# EAGLE design quad7seg (EAGLE 7.3.0)
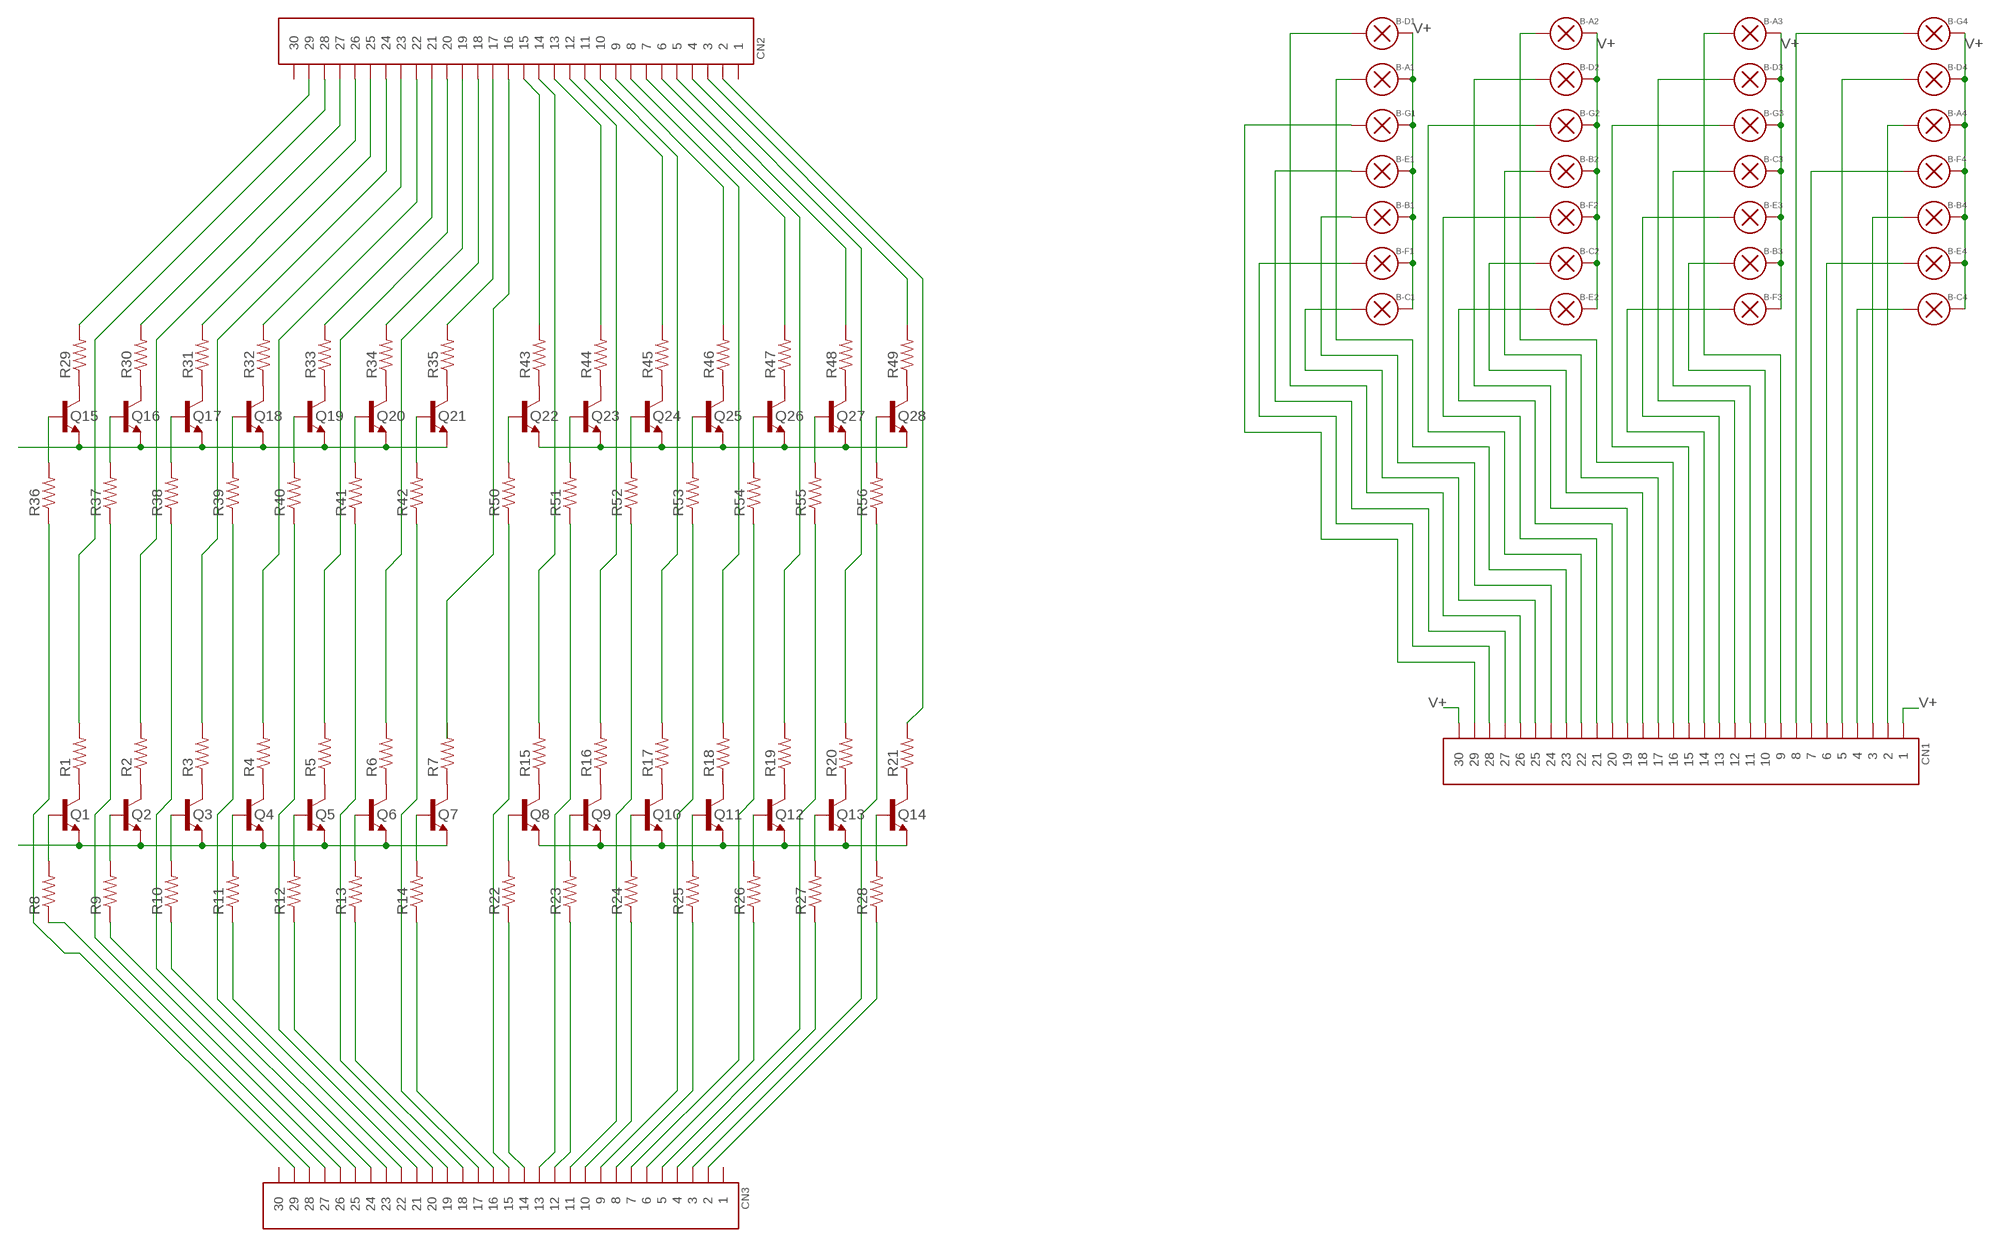
[diagram p0: schematic, sheet 1]

## Parts
B-A1  BULB-N  [4X11BULB1]
B-A2  BULB-N  [4X11BULB1]
B-A3  BULB-N  [4X11BULB1]
B-A4  BULB-N  [4X11BULB1]
B-B1  BULB-F  [4X11BULB2]
B-B2  BULB-F  [4X11BULB2]
B-B3  BULB-F  [4X11BULB2]
B-B4  BULB-F  [4X11BULB2]
B-C1  BULB-F  [4X11BULB2]
B-C2  BULB-F  [4X11BULB2]
B-C3  BULB-F  [4X11BULB2]
B-C4  BULB-F  [4X11BULB2]
B-D1  BULB-N  [4X11BULB1]
B-D2  BULB-N  [4X11BULB1]
B-D3  BULB-N  [4X11BULB1]
B-D4  BULB-N  [4X11BULB1]
B-E1  BULB-F  [4X11BULB2]
B-E2  BULB-F  [4X11BULB2]
B-E3  BULB-F  [4X11BULB2]
B-E4  BULB-F  [4X11BULB2]
B-F1  BULB-F  [4X11BULB2]
B-F2  BULB-F  [4X11BULB2]
B-F3  BULB-F  [4X11BULB2]
B-F4  BULB-F  [4X11BULB2]
B-G1  BULB-N  [4X11BULB1]
B-G2  BULB-N  [4X11BULB1]
B-G3  BULB-N  [4X11BULB1]
B-G4  BULB-N  [4X11BULB1]
CN1  HD30  [HD30]
CN2  HD30  [HD30]
CN3  HD30  [HD30]
Q1  2N3904-1  [TO92BH]
Q2  2N3904-1  [TO92BH]
Q3  2N3904-1  [TO92BH]
Q4  2N3904-1  [TO92BH]
Q5  2N3904-1  [TO92BH]
Q6  2N3904-1  [TO92BH]
Q7  2N3904-1  [TO92BH]
Q8  2N3904-1  [TO92BH]
Q9  2N3904-1  [TO92BH]
Q10  2N3904-1  [TO92BH]
Q11  2N3904-1  [TO92BH]
Q12  2N3904-1  [TO92BH]
Q13  2N3904-1  [TO92BH]
Q14  2N3904-1  [TO92BH]
Q15  2N3904-1  [TO92BH]
Q16  2N3904-1  [TO92BH]
Q17  2N3904-1  [TO92BH]
Q18  2N3904-1  [TO92BH]
Q19  2N3904-1  [TO92BH]
Q20  2N3904-1  [TO92BH]
Q21  2N3904-1  [TO92BH]
Q22  2N3904-1  [TO92BH]
Q23  2N3904-1  [TO92BH]
Q24  2N3904-1  [TO92BH]
Q25  2N3904-1  [TO92BH]
Q26  2N3904-1  [TO92BH]
Q27  2N3904-1  [TO92BH]
Q28  2N3904-1  [TO92BH]
R1  R1/8-7.6MM  [R0125-7.6]
R2  R1/8-7.6MM  [R0125-7.6]
R3  R1/8-7.6MM  [R0125-7.6]
R4  R1/8-7.6MM  [R0125-7.6]
R5  R1/8-7.6MM  [R0125-7.6]
R6  R1/8-7.6MM  [R0125-7.6]
R7  R1/8-7.6MM  [R0125-7.6]
R8  R1/8-7.6MM  [R0125-7.6]
R9  R1/8-7.6MM  [R0125-7.6]
R10  R1/8-7.6MM  [R0125-7.6]
R11  R1/8-7.6MM  [R0125-7.6]
R12  R1/8-7.6MM  [R0125-7.6]
R13  R1/8-7.6MM  [R0125-7.6]
R14  R1/8-7.6MM  [R0125-7.6]
R15  R1/8-7.6MM  [R0125-7.6]
R16  R1/8-7.6MM  [R0125-7.6]
R17  R1/8-7.6MM  [R0125-7.6]
R18  R1/8-7.6MM  [R0125-7.6]
R19  R1/8-7.6MM  [R0125-7.6]
R20  R1/8-7.6MM  [R0125-7.6]
R21  R1/8-7.6MM  [R0125-7.6]
R22  R1/8-7.6MM  [R0125-7.6]
R23  R1/8-7.6MM  [R0125-7.6]
R24  R1/8-7.6MM  [R0125-7.6]
R25  R1/8-7.6MM  [R0125-7.6]
R26  R1/8-7.6MM  [R0125-7.6]
R27  R1/8-7.6MM  [R0125-7.6]
R28  R1/8-7.6MM  [R0125-7.6]
R29  R1/8-7.6MM  [R0125-7.6]
R30  R1/8-7.6MM  [R0125-7.6]
R31  R1/8-7.6MM  [R0125-7.6]
R32  R1/8-7.6MM  [R0125-7.6]
R33  R1/8-7.6MM  [R0125-7.6]
R34  R1/8-7.6MM  [R0125-7.6]
R35  R1/8-7.6MM  [R0125-7.6]
R36  R1/8-7.6MM  [R0125-7.6]
R37  R1/8-7.6MM  [R0125-7.6]
R38  R1/8-7.6MM  [R0125-7.6]
R39  R1/8-7.6MM  [R0125-7.6]
R40  R1/8-7.6MM  [R0125-7.6]
R41  R1/8-7.6MM  [R0125-7.6]
R42  R1/8-7.6MM  [R0125-7.6]
R43  R1/8-7.6MM  [R0125-7.6]
R44  R1/8-7.6MM  [R0125-7.6]
R45  R1/8-7.6MM  [R0125-7.6]
R46  R1/8-7.6MM  [R0125-7.6]
R47  R1/8-7.6MM  [R0125-7.6]
R48  R1/8-7.6MM  [R0125-7.6]
R49  R1/8-7.6MM  [R0125-7.6]
R50  R1/8-7.6MM  [R0125-7.6]
R51  R1/8-7.6MM  [R0125-7.6]
R52  R1/8-7.6MM  [R0125-7.6]
R53  R1/8-7.6MM  [R0125-7.6]
R54  R1/8-7.6MM  [R0125-7.6]
R55  R1/8-7.6MM  [R0125-7.6]
R56  R1/8-7.6MM  [R0125-7.6]

## Nets
GND: Q1.1(E) Q2.1(E) Q3.1(E) Q4.1(E) Q5.1(E) Q6.1(E) Q7.1(E) Q8.1(E) Q9.1(E) Q10.1(E) Q11.1(E) Q12.1(E) Q13.1(E) Q14.1(E) Q15.1(E) Q16.1(E) Q17.1(E) Q18.1(E) Q19.1(E) Q20.1(E) Q21.1(E) Q22.1(E) Q23.1(E) Q24.1(E) Q25.1(E) Q26.1(E) Q27.1(E) Q28.1(E)
N$1: Q1.3(C) R1.1
N$2: Q2.3(C) R2.1
N$3: Q3.3(C) R3.1
N$4: Q4.3(C) R4.1
N$5: Q5.3(C) R5.1
N$6: Q6.3(C) R6.1
N$7: Q7.3(C) R7.1
N$8 [data]: Q1.2(B) R8.2
N$9 [data]: Q2.2(B) R9.2
N$10 [data]: Q3.2(B) R10.2
N$11 [data]: Q4.2(B) R11.2
N$12 [data]: Q5.2(B) R12.2
N$13 [data]: Q6.2(B) R13.2
N$14 [data]: Q7.2(B) R14.2
N$15 [bulb]: B-A4.P$1 CN1.P$2
N$16: Q8.3(C) R15.1
N$17: Q9.3(C) R16.1
N$18: Q10.3(C) R17.1
N$19: Q11.3(C) R18.1
N$20: Q12.3(C) R19.1
N$21: Q13.3(C) R20.1
N$22: Q14.3(C) R21.1
N$23 [data]: Q8.2(B) R22.2
N$24 [data]: Q9.2(B) R23.2
N$25 [data]: Q10.2(B) R24.2
N$26 [data]: Q11.2(B) R25.2
N$27 [data]: Q12.2(B) R26.2
N$28 [data]: Q13.2(B) R27.2
N$29 [data]: Q14.2(B) R28.2
N$30 [bulb]: B-B4.P$1 CN1.P$3
N$31: Q15.3(C) R29.1
N$32: Q16.3(C) R30.1
N$33: Q17.3(C) R31.1
N$34: Q18.3(C) R32.1
N$35: Q19.3(C) R33.1
N$36: Q20.3(C) R34.1
N$37: Q21.3(C) R35.1
N$38 [data]: Q15.2(B) R36.2
N$39 [data]: Q16.2(B) R37.2
N$40 [data]: Q17.2(B) R38.2
N$41 [data]: Q18.2(B) R39.2
N$42 [data]: Q19.2(B) R40.2
N$43 [data]: Q20.2(B) R41.2
N$44 [data]: Q21.2(B) R42.2
N$45 [bulb]: B-C4.P$1 CN1.P$4
N$46: Q22.3(C) R43.1
N$47: Q23.3(C) R44.1
N$48: Q24.3(C) R45.1
N$49: Q25.3(C) R46.1
N$50: Q26.3(C) R47.1
N$51: Q27.3(C) R48.1
N$52: Q28.3(C) R49.1
N$53 [data]: Q22.2(B) R50.2
N$54 [data]: Q23.2(B) R51.2
N$55 [data]: Q24.2(B) R52.2
N$56 [data]: Q25.2(B) R53.2
N$57 [data]: Q26.2(B) R54.2
N$58 [data]: Q27.2(B) R55.2
N$59 [data]: Q28.2(B) R56.2
N$60 [data]: CN3.P$29 R36.1
N$61: CN2.P$3 R49.2
N$62: CN2.P$5 R48.2
N$63: CN2.P$7 R47.2
N$64: CN2.P$9 R46.2
N$65: CN2.P$11 R45.2
N$66: CN2.P$13 R44.2
N$67: CN2.P$15 R43.2
N$68: CN2.P$17 R35.2
N$69: CN2.P$19 R34.2
N$70: CN2.P$21 R33.2
N$71: CN2.P$23 R32.2
N$72: CN2.P$25 R31.2
N$73: CN2.P$27 R30.2
N$74: CN2.P$29 R29.2
N$75: CN2.P$2 R21.2
N$76: CN2.P$4 R20.2
N$77: CN2.P$6 R19.2
N$78: CN2.P$8 R18.2
N$79: CN2.P$10 R17.2
N$80: CN2.P$12 R16.2
N$81: CN2.P$14 R15.2
N$82: CN2.P$16
N$83: CN2.P$18 R6.2
N$84: CN2.P$20 R5.2
N$85: CN2.P$22 R4.2
N$86: CN2.P$24 R3.2
N$87: CN2.P$26 R2.2
N$88: CN2.P$28 R1.2
N$89 [data]: CN3.P$2 R28.1
N$90 [data]: CN3.P$4 R27.1
N$91 [data]: CN3.P$6 R26.1
N$92 [data]: CN3.P$8 R25.1
N$93 [data]: CN3.P$10 R24.1
N$94 [data]: CN3.P$12 R23.1
N$95 [data]: CN3.P$14 R22.1
N$96 [data]: CN3.P$16 R14.1
N$97 [data]: CN3.P$18 R13.1
N$98 [data]: CN3.P$20 R12.1
N$99 [data]: CN3.P$22 R11.1
N$100: CN3.P$24 R10.1
N$101 [data]: CN3.P$26 R9.1
N$102 [data]: CN3.P$28 R8.1
N$103 [data]: CN3.P$3 R56.1
N$104 [data]: CN3.P$5 R55.1
N$105 [data]: CN3.P$7 R54.1
N$106 [data]: CN3.P$9 R53.1
N$107 [data]: CN3.P$11 R52.1
N$108 [data]: CN3.P$13 R51.1
N$109 [data]: CN3.P$15 R50.1
N$110 [data]: CN3.P$17 R42.1
N$111 [data]: CN3.P$19 R41.1
N$112 [data]: CN3.P$21 R40.1
N$113 [data]: CN3.P$23 R39.1
N$114 [data]: CN3.P$25 R38.1
N$115 [data]: CN3.P$27 R37.1
N$116 [bulb]: B-D4.P$1 CN1.P$5
N$117 [bulb]: B-E4.P$1 CN1.P$6
N$118 [bulb]: B-F4.P$1 CN1.P$7
N$119 [bulb]: B-G4.P$1 CN1.P$8
N$120 [bulb]: B-A3.P$1 CN1.P$9
N$121 [bulb]: B-B3.P$1 CN1.P$10
N$122 [bulb]: B-C3.P$1 CN1.P$11
N$123 [bulb]: B-D3.P$1 CN1.P$12
N$124 [bulb]: B-E3.P$1 CN1.P$13
N$125 [bulb]: B-F3.P$1 CN1.P$14
N$126 [bulb]: B-G3.P$1 CN1.P$15
N$127 [bulb]: B-A2.P$1 CN1.P$16
N$128 [bulb]: B-B2.P$1 CN1.P$17
N$129 [bulb]: B-C2.P$1 CN1.P$18
N$130 [bulb]: B-D2.P$1 CN1.P$19
N$131 [bulb]: B-E2.P$1 CN1.P$20
N$132 [bulb]: B-F2.P$1 CN1.P$21
N$133 [bulb]: B-G2.P$1 CN1.P$22
N$134 [bulb]: B-A1.P$1 CN1.P$23
N$135 [bulb]: B-B1.P$1 CN1.P$24
N$136 [bulb]: B-C1.P$1 CN1.P$25
N$137 [bulb]: B-D1.P$1 CN1.P$26
N$138 [bulb]: B-E1.P$1 CN1.P$27
N$139 [bulb]: B-F1.P$1 CN1.P$28
N$140 [bulb]: B-G1.P$1 CN1.P$29
V+: B-A1.P$2 B-A2.P$2 B-A3.P$2 B-A4.P$2 B-B1.P$2 B-B2.P$2 B-B3.P$2 B-B4.P$2 B-C1.P$2 B-C2.P$2 B-C3.P$2 B-C4.P$2 B-D1.P$2 B-D2.P$2 B-D3.P$2 B-D4.P$2 B-E1.P$2 B-E2.P$2 B-E3.P$2 B-E4.P$2 B-F1.P$2 B-F2.P$2 B-F3.P$2 B-F4.P$2 B-G1.P$2 B-G2.P$2 B-G3.P$2 B-G4.P$2 CN1.P$1 CN1.P$30
Unconnected: CN2.P$1 CN2.P$30 CN3.P$1 CN3.P$30 R7.2

## Library data of the parts
B-A1-B-A4 B-B1-B-B4 B-C1-B-C4 B-D1-B-D4 B-E1-B-E4 B-F1-B-F4 B-G1-B-G4 = SmallRoomLabs_Led:BULB
CN1-CN3 = SmallRoomLabs_ConSwitch:HD30
Q1-Q28 = SmallRoomLabs_Semiconductor:2N3904
R1-R56 = SmallRoomLabs_Discrete:R

## Net classes
0 default: width 0.305 mm, drill 0.305 mm, clearance 0.203 mm
1 bulb: width 0.203 mm, drill 0.305 mm, clearance 0.203 mm
2 data: width 0.203 mm, drill 0.305 mm, clearance 0.203 mm

## Board
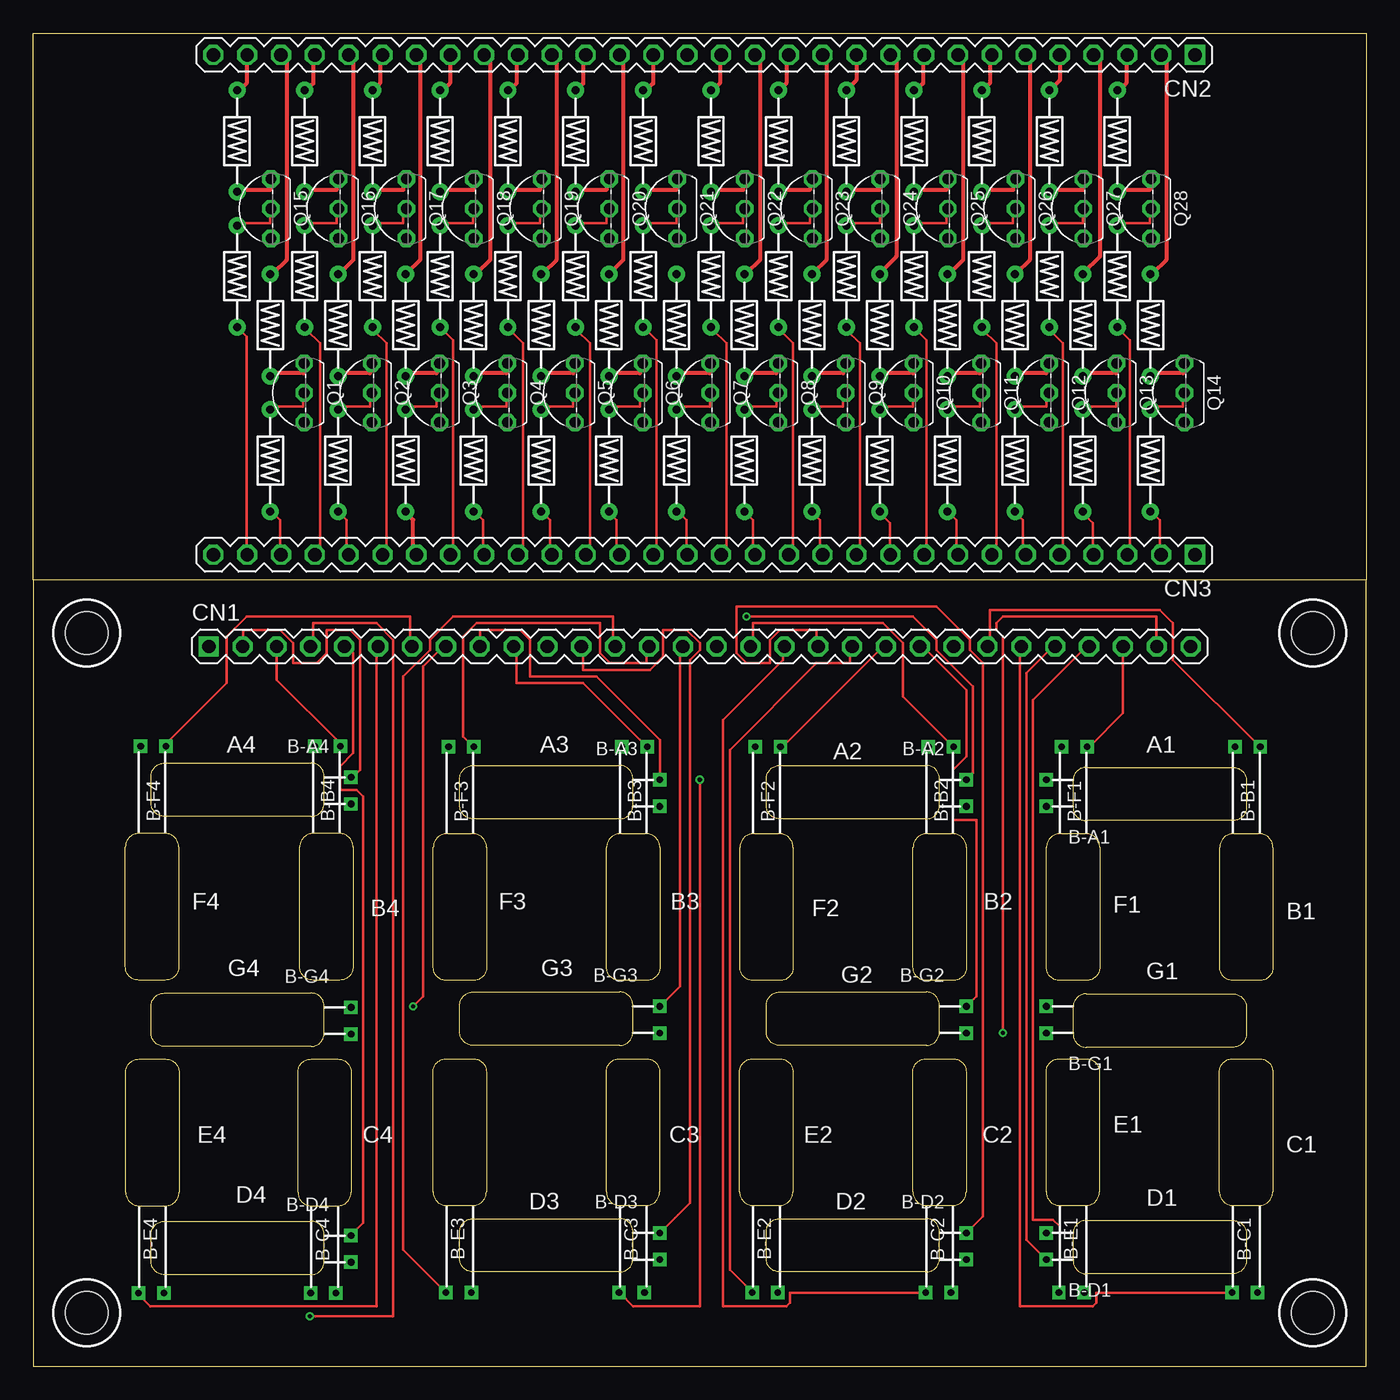
[diagram p1: board, top side]
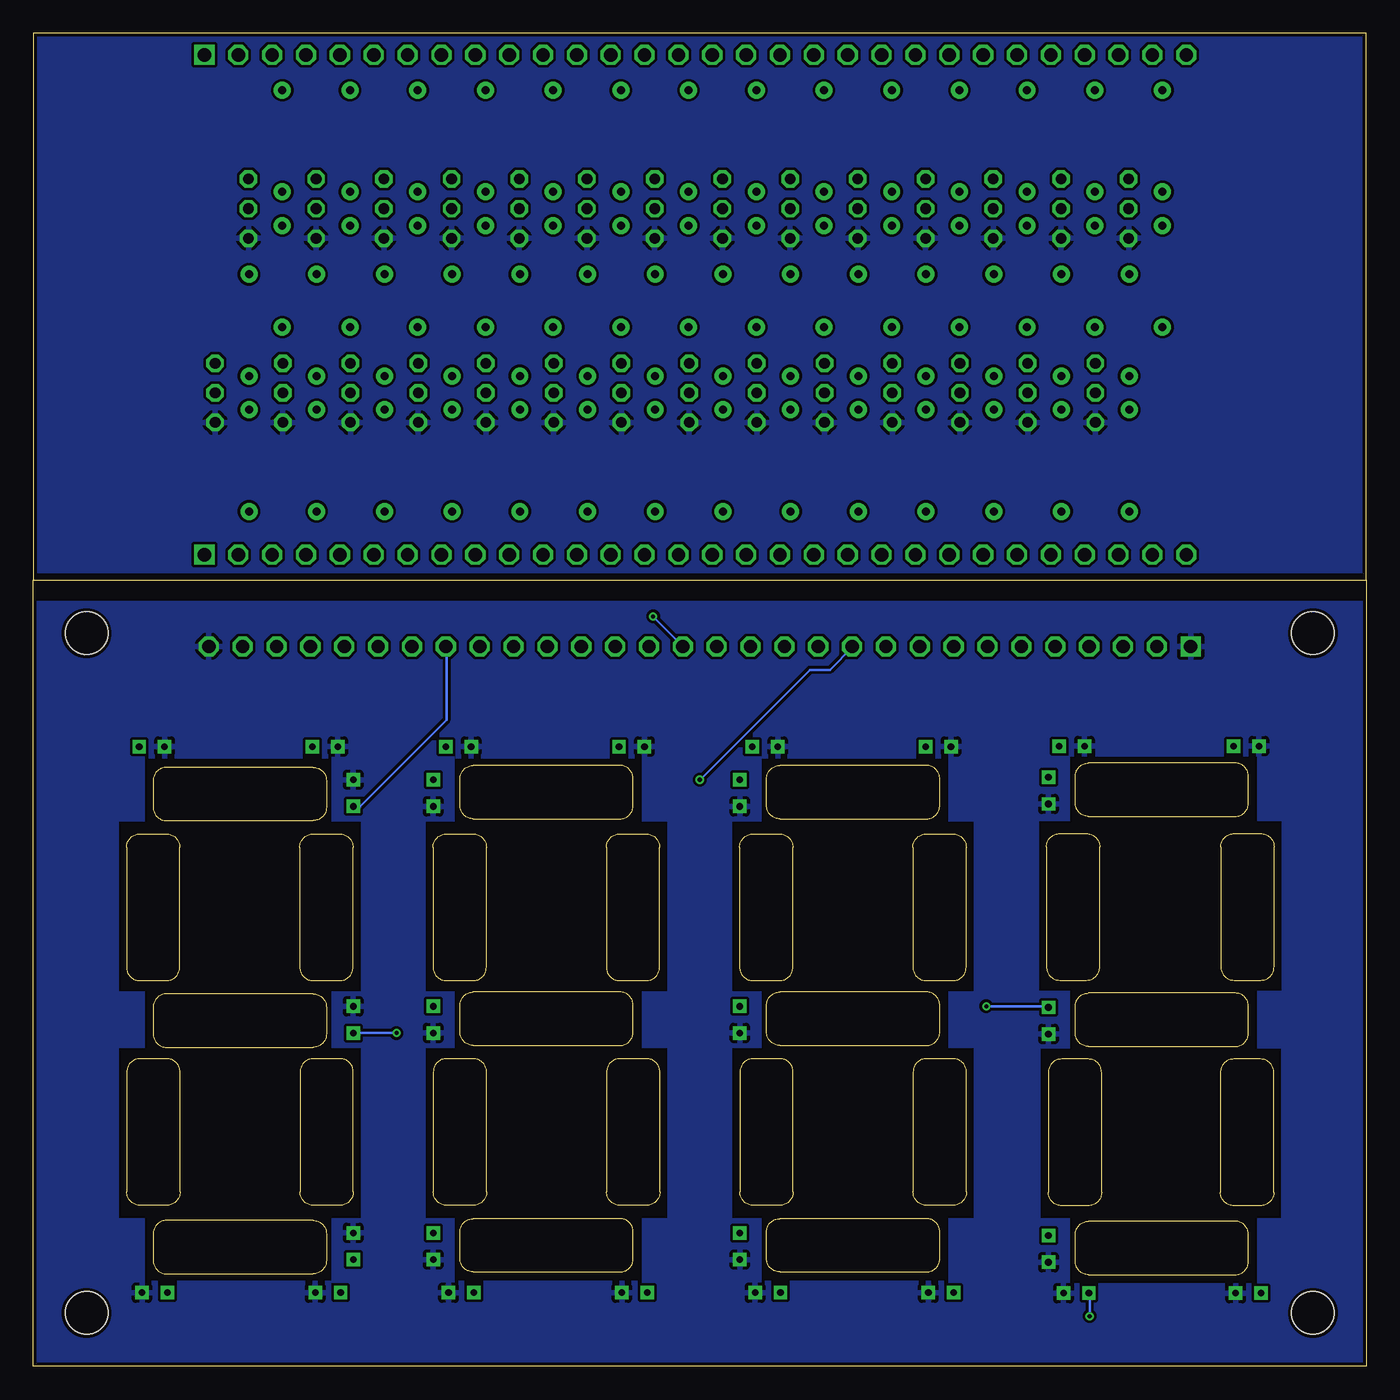
[diagram p2: board, bottom side, seen from below]

Size 100 x 100 mm. Coordinates in mm from the lower left corner, seen from the top.
Outline: 0,59 0,0 100,0 100,59
Outline: 100,59 0,59
Outline: 0,59 0,100 100,100 100,59
Copper layers (1*16): Top 0.035mm / dielectric 1.5mm / Bottom 0.035mm
Design rules "dirt_cheap_dirty_boards.v1": minimum track width 5mil, minimum drill 12mil, track to track 5mil, track to pad 5mil, pad to pad 5mil, via to via 5mil, smd to smd 0mil, copper to edge 10mil, drill to drill 10mil, minimum pad ring 10mil, minimum via ring 6mil, stop-mask expansion 2mil, vias tented up to drill 25mil, thermal gap 10mil
Holes 3.2 mm at 4,55 4,4 96,55 96,4

### Footprints (pad centres in the part's own frame; a part is rotated, then mirrored left to right if it is on the bottom)
4X11BULB1 = drill 0.5 square: P$1 1,-8; P$2 -1,-8
4X11BULB2 = drill 0.5 square: P$1 -1.055,-11.985; P$2 0.85,-11.985
HD30 = drill 1 square: P$1 -36.83,0 | drill 1 octagon: P$2 -34.29,0; P$3 -31.75,0; P$4 -29.21,0; P$5 -26.67,0; P$6 -24.13,0; P$7 -21.59,0; P$8 -19.05,0; P$9 -16.51,0; P$10 -13.97,0; P$11 -11.43,0; P$12 -8.89,0; P$13 -6.35,0; P$14 -3.81,0; P$15 -1.27,0; P$16 1.27,0; P$17 3.81,0; P$18 6.35,0; P$19 8.89,0; P$20 11.43,0; P$21 13.97,0; P$22 16.51,0; P$23 19.05,0; P$24 21.59,0; P$25 24.13,0; P$26 26.67,0; P$27 29.21,0; P$28 31.75,0; P$29 34.29,0; P$30 36.83,0
TO92BH = drill 0.8 octagon: 1 -2.223,0; 2 0,0; 3 2.223,0
R0125-7.6 = drill 0.6 pad 1.27: 1 -3.81,0; 2 3.81,0

### Placement (x,y rotation side)
B-A1  84,43 270 top
B-A2  62,43 90 top
B-A3  39,43 90 top
B-A4  15.84,43.18 90 top
B-B1  91,34.5 180 top
B-B2  68,34.5 180 top
B-B3  45,34.5 180 top
B-B4  21.98,34.53 180 top
B-C1  91,17.5 0 top
B-C2  68,17.5 0 top
B-C3  45,17.5 0 top
B-C4  21.86,17.47 0 top
B-D1  84,9 270 top
B-D2  62,9 90 top
B-D3  39,9 90 top
B-D4  15.84,8.8 90 top
B-E1  78,17.5 0 top
B-E2  55,17.5 0 top
B-E3  32,17.5 0 top
B-E4  8.94,17.47 0 top
B-F1  78,34.5 180 top
B-F2  55,34.5 180 top
B-F3  32,34.5 180 top
B-F4  8.9,34.53 180 top
B-G1  84,26 270 top
B-G2  62,26 90 top
B-G3  39,26 90 top
B-G4  15.84,25.92 90 top
CN1  50,54 0 top
CN2  50.33,98.39 180 top
CN3  50.33,60.88 180 top
Q1  20.32,73.03 90 top
Q2  25.4,73.03 90 top
Q3  30.48,73.03 90 top
Q4  35.56,73.03 90 top
Q5  40.64,73.03 90 top
Q6  45.72,73.03 90 top
Q7  50.8,73.03 90 top
Q8  55.88,73.03 90 top
Q9  60.96,73.03 90 top
Q10  66.04,73.03 90 top
Q11  71.12,73.03 90 top
Q12  76.2,73.03 90 top
Q13  81.28,73.03 90 top
Q14  86.36,73.03 90 top
Q15  17.82,86.84 90 top
Q16  22.9,86.84 90 top
Q17  27.98,86.84 90 top
Q18  33.06,86.84 90 top
Q19  38.14,86.84 90 top
Q20  43.22,86.84 90 top
Q21  48.3,86.84 90 top
Q22  53.38,86.84 90 top
Q23  58.46,86.84 90 top
Q24  63.54,86.84 90 top
Q25  68.62,86.84 90 top
Q26  73.7,86.84 90 top
Q27  78.78,86.84 90 top
Q28  83.86,86.84 90 top
R1  17.78,78.11 90 top
R2  22.86,78.11 90 top
R3  27.94,78.11 90 top
R4  33.02,78.11 90 top
R5  38.1,78.11 90 top
R6  43.18,78.11 90 top
R7  48.26,78.11 90 top
R8  17.78,67.94 90 top
R9  22.86,67.94 90 top
R10  27.94,67.94 90 top
R11  33.02,67.94 90 top
R12  38.1,67.94 90 top
R13  43.18,67.94 90 top
R14  48.26,67.94 90 top
R15  53.34,78.11 90 top
R16  58.42,78.11 90 top
R17  63.5,78.11 90 top
R18  68.58,78.11 90 top
R19  73.66,78.11 90 top
R20  78.74,78.11 90 top
R21  83.82,78.11 90 top
R22  53.34,67.94 90 top
R23  58.42,67.94 90 top
R24  63.5,67.94 90 top
R25  68.58,67.94 90 top
R26  73.66,67.94 90 top
R27  78.74,67.94 90 top
R28  83.82,67.94 90 top
R29  15.28,91.92 90 top
R30  20.36,91.92 90 top
R31  25.44,91.92 90 top
R32  30.52,91.92 90 top
R33  35.6,91.92 90 top
R34  40.68,91.92 90 top
R35  45.76,91.92 90 top
R36  15.28,81.77 90 top
R37  20.36,81.77 90 top
R38  25.44,81.77 90 top
R39  30.52,81.77 90 top
R40  35.6,81.77 90 top
R41  40.68,81.77 90 top
R42  45.76,81.77 90 top
R43  50.84,91.92 90 top
R44  55.92,91.92 90 top
R45  61,91.92 90 top
R46  66.08,91.92 90 top
R47  71.16,91.92 90 top
R48  76.24,91.92 90 top
R49  81.32,91.92 90 top
R50  50.84,81.77 90 top
R51  55.92,81.77 90 top
R52  61,81.77 90 top
R53  66.08,81.77 90 top
R54  71.16,81.77 90 top
R55  76.24,81.77 90 top
R56  81.32,81.77 90 top

### Tracks (layer width: path | path; a pad name or v marks a point on that pad's centre or on a via)
GND
  pour Bottom: 0,100.33 0,59.69 100.33,59.69 100.33,100.33
N$1
  Top 0.305: R1.1 18,74.5 20.25,74.5 20.25,75 Q1.3
N$2
  Top 0.305: R2.1 23,74.5 25.25,74.5 25.25,75 Q2.3
N$3
  Top 0.305: R3.1 28,74.5 30.25,74.5 30.25,75 Q3.3
N$4
  Top 0.305: R4.1 33.25,74.5 35.5,74.5 35.5,75 Q4.3
N$5
  Top 0.305: R5.1 38.25,74.5 40.5,74.5 40.5,75 Q5.3
N$6
  Top 0.305: R6.1 43.25,74.5 45.5,74.5 45.5,75 Q6.3
N$7
  Top 0.305: R7.1 48.5,74.5 50.75,74.5 50.75,75 Q7.3
N$8
  Top 0.203: R8.2 18,72 20.25,72 20.25,73 Q1.2
N$9
  Top 0.203: R9.2 23,72 25.25,72 25.25,73 Q2.2
N$10
  Top 0.203: R10.2 28,72 30.25,72 30.25,73 Q3.2
N$11
  Top 0.203: R11.2 33.25,72 35.5,72 35.5,73 Q4.2
N$12
  Top 0.203: R12.2 38.25,72 40.5,72 40.5,73 Q5.2
N$13
  Top 0.203: R13.2 43.25,72 45.5,72 45.5,73 Q6.2
N$14
  Top 0.203: R14.2 48.5,72 50.75,72 50.75,73 Q7.2
N$15
  Top 0.203: B-A4.P$1 24,44.25 24.5,44.75 24.5,54.5 23.75,55.25 22,55.25 22,53.5 21.25,52.75 19.5,52.75 19.5,54.25 18.5,55.25 15.75,55.25 15.75,54 CN1.P$2
N$16
  Top 0.305: R15.1 53.5,74.5 55.75,74.5 55.75,75 Q8.3
N$17
  Top 0.305: R16.1 58.5,74.5 60.75,74.5 60.75,75 Q9.3
N$18
  Top 0.305: R17.1 63.5,74.5 66,74.5 66,75 Q10.3
N$19
  Top 0.305: R18.1 68.75,74.5 71,74.5 71,75 Q11.3
N$20
  Top 0.305: R19.1 73.75,74.5 76,74.5 76,75 Q12.3
N$21
  Top 0.305: R20.1 78.75,74.5 81.25,74.5 81.25,75 Q13.3
N$22
  Top 0.305: R21.1 84,74.5 86.25,74.5 86.25,75 Q14.3
N$23
  Top 0.203: R22.2 53.5,72 55.75,72 55.75,73 Q8.2
N$24
  Top 0.203: R23.2 58.5,72 60.75,72 60.75,73 Q9.2
N$25
  Top 0.203: R24.2 63.5,72 66,72 66,73 Q10.2
N$26
  Top 0.203: R25.2 68.75,72 71,72 71,73 Q11.2
N$27
  Top 0.203: R26.2 73.75,72 76,72 76,73 Q12.2
N$28
  Top 0.203: R27.2 78.75,72 81.25,72 81.25,73 Q13.2
N$29
  Top 0.203: R28.2 84,72 86.25,72 86.25,73 Q14.2
N$30
  Top 0.203: CN1.P$3 18.25,51.5 23,46.75 B-B4.P$1
N$31
  Top 0.305: R29.1 15.5,88.25 17.75,88.25 17.75,89 Q15.3
N$32
  Top 0.305: R30.1 20.5,88.25 22.75,88.25 22.75,89 Q16.3
N$33
  Top 0.305: R31.1 25.5,88.25 27.75,88.25 27.75,89 Q17.3
N$34
  Top 0.305: R32.1 30.75,88.25 33,88.25 33,89 Q18.3
N$35
  Top 0.305: R33.1 35.75,88.25 38,88.25 38,89 Q19.3
N$36
  Top 0.305: R34.1 40.75,88.25 43,88.25 43,89 Q20.3
N$37
  Top 0.305: R35.1 46,88.25 48.25,88.25 48.25,89 Q21.3
N$38
  Top 0.203: R36.2 15.5,85.75 17.75,85.75 17.75,86.75 Q15.2
N$39
  Top 0.203: R37.2 20.5,85.75 22.75,85.75 22.75,86.75 Q16.2
N$40
  Top 0.203: R38.2 25.5,85.75 27.75,85.75 27.75,86.75 Q17.2
N$41
  Top 0.203: R39.2 30.75,85.75 33,85.75 33,86.75 Q18.2
N$42
  Top 0.203: R40.2 35.75,85.75 38,85.75 38,86.75 Q19.2
N$43
  Top 0.203: R41.2 40.75,85.75 43,85.75 43,86.75 Q20.2
N$44
  Top 0.203: R42.2 46,85.75 48.25,85.75 48.25,86.75 Q21.2
N$45  (via drill 0.3)
  Top 0.203: v20.75,3.75 27,3.75 27,54.5 25.75,55.75 21,55.75 21,54 CN1.P$4
  Bottom 0.203: v20.75,3.75 20.75,5.25 B-C4.P$1
N$46
  Top 0.305: R43.1 51,88.25 53.25,88.25 53.25,89 Q22.3
N$47
  Top 0.305: R44.1 56,88.25 58.25,88.25 58.25,89 Q23.3
N$48
  Top 0.305: R45.1 61,88.25 63.5,88.25 63.5,89 Q24.3
N$49
  Top 0.305: R46.1 66.25,88.25 68.5,88.25 68.5,89 Q25.3
N$50
  Top 0.305: R47.1 71.25,88.25 73.5,88.25 73.5,89 Q26.3
N$51
  Top 0.305: R48.1 76.25,88.25 78.75,88.25 78.75,89 Q27.3
N$52
  Top 0.305: R49.1 81.5,88.25 83.75,88.25 83.75,89 Q28.3
N$53
  Top 0.203: R50.2 51,85.75 53.25,85.75 53.25,86.75 Q22.2
N$54
  Top 0.203: R51.2 56,85.75 58.25,85.75 58.25,86.75 Q23.2
N$55
  Top 0.203: R52.2 61,85.75 63.5,85.75 63.5,86.75 Q24.2
N$56
  Top 0.203: R53.2 66.25,85.75 68.5,85.75 68.5,86.75 Q25.2
N$57
  Top 0.203: R54.2 71.25,85.75 73.5,85.75 73.5,86.75 Q26.2
N$58
  Top 0.203: R55.2 76.25,85.75 78.75,85.75 78.75,86.75 Q27.2
N$59
  Top 0.203: R56.2 81.5,85.75 83.75,85.75 83.75,86.75 Q28.2
N$60
  Top 0.203: R36.1 15.5,77.75 16,77.25 16,61 CN3.P$29
N$61
  Top 0.305: R49.2 81.5,95.75 82,96.25 82,98.25 CN2.P$3
N$62
  Top 0.305: CN2.P$5 77,96.5 76.25,95.75 R48.2
N$63
  Top 0.305: R47.2 71.25,95.75 71.75,96.25 71.75,98.25 CN2.P$7
N$64
  Top 0.305: R46.2 66.25,95.75 66.75,96.25 66.75,98.25 CN2.P$9
N$65
  Top 0.305: R45.2 61,95.75 61.75,96.5 61.75,98.25 CN2.P$11
N$66
  Top 0.305: R44.2 56,95.75 56.5,96.25 56.5,98.25 CN2.P$13
N$67
  Top 0.305: R43.2 51,95.75 51.5,96.25 51.5,98.25 CN2.P$15
N$68
  Top 0.305: R35.2 46,95.75 46.5,96.25 46.5,98.25 CN2.P$17
N$69
  Top 0.305: R34.2 40.75,95.75 41.25,96.25 41.25,98.25 CN2.P$19
N$70
  Top 0.305: R33.2 35.75,95.75 36.25,96.25 36.25,98.25 CN2.P$21
N$71
  Top 0.305: R32.2 30.75,95.75 31.25,96.25 31.25,98.25 CN2.P$23
N$72
  Top 0.305: R31.2 25.5,95.75 26,96.25 26,98.25 CN2.P$25
N$73
  Top 0.305: R30.2 20.5,95.75 21,96.25 21,98.25 CN2.P$27
N$74
  Top 0.305: R29.2 15.5,95.75 16,96.25 16,98.25 CN2.P$29
N$75
  Top 0.305: R21.2 84,82 85,83 85,98 84.75,98.25 CN2.P$2
N$76
  Top 0.305: R20.2 78.75,82 80,83.25 80,98 79.75,98.25 CN2.P$4
N$77
  Top 0.305: R19.2 73.75,82 74.75,83 74.75,98 74.5,98.25 CN2.P$6
N$78
  Top 0.305: R18.2 68.75,82 69.75,83 69.75,98 69.5,98.25 CN2.P$8
N$79
  Top 0.305: R17.2 63.5,82 64.75,83.25 64.75,98 64.5,98.25 CN2.P$10
N$80
  Top 0.305: R16.2 58.5,82 59.5,83 59.5,98 59.25,98.25 CN2.P$12
N$81
  Top 0.305: R15.2 53.5,82 54.5,83 54.5,98 54.25,98.25 CN2.P$14
N$83
  Top 0.305: R6.2 43.25,82 44.25,83 44.25,98 44,98.25 CN2.P$18
N$84
  Top 0.305: R5.2 38.25,82 39.25,83 39.25,98 39,98.25 CN2.P$20
N$85
  Top 0.305: R4.2 33.25,82 34.25,83 34.25,98 34,98.25 CN2.P$22
N$86
  Top 0.305: R3.2 28,82 29,83 29,98 28.75,98.25 CN2.P$24
N$87
  Top 0.305: R2.2 23,82 24,83 24,98 23.75,98.25 CN2.P$26
N$88
  Top 0.305: R1.2 18,82 19,83 19,98 18.75,98.25 CN2.P$28
N$89
  Top 0.203: R28.1 84,64 84.5,63.5 84.5,61 CN3.P$2
N$90
  Top 0.203: R27.1 78.75,64 79.5,63.25 79.5,61 CN3.P$4
N$91
  Top 0.203: R26.1 73.75,64 74.25,63.5 74.25,61 CN3.P$6
N$92
  Top 0.203: R25.1 68.75,64 69.25,63.5 69.25,61 CN3.P$8
N$93
  Top 0.203: R24.1 63.5,64 64.25,63.25 64.25,61 CN3.P$10
N$94
  Top 0.203: R23.1 58.5,64 59,63.5 59,61 CN3.P$12
N$95
  Top 0.203: R22.1 53.5,64 54,63.5 54,61 CN3.P$14
N$96
  Top 0.203: R14.1 48.5,64 49,63.5 49,61 CN3.P$16
N$97
  Top 0.203: R13.1 43.25,64 43.75,63.5 43.75,61 CN3.P$18
N$98
  Top 0.203: R12.1 38.25,64 38.75,63.5 38.75,61 CN3.P$20
N$99
  Top 0.203: R11.1 33.25,64 33.75,63.5 33.75,61 CN3.P$22
N$100
  Top 0.305: R10.1 28,64 28.5,63.5 28.5,61 CN3.P$24
N$101
  Top 0.203: R9.1 23,64 23.5,63.5 23.5,61 CN3.P$26
N$102
  Top 0.203: R8.1 18,64 18.5,63.5 18.5,61 CN3.P$28
N$103
  Top 0.203: R56.1 81.5,77.75 82.25,77 82.25,61 CN3.P$3
N$104
  Top 0.203: R55.1 76.25,77.75 77.25,76.75 77.25,61.25 77,61 CN3.P$5
N$105
  Top 0.203: R54.1 71.25,77.75 72.25,76.75 72.25,61.25 72,61 CN3.P$7
N$106
  Top 0.203: R53.1 66.25,77.75 67,77 67,61 CN3.P$9
N$107
  Top 0.203: R52.1 61,77.75 62,76.75 62,61 CN3.P$11
N$108
  Top 0.203: R51.1 56,77.75 57,76.75 57,61.25 56.75,61 CN3.P$13
N$109
  Top 0.203: R50.1 51,77.75 52,76.75 52,61.25 51.75,61 CN3.P$15
N$110
  Top 0.203: R42.1 46,77.75 46.75,77 46.75,61 CN3.P$17
N$111
  Top 0.203: R41.1 40.75,77.75 41.75,76.75 41.75,61.25 41.5,61 CN3.P$19
N$112
  Top 0.203: R40.1 35.75,77.75 36.75,76.75 36.75,61.25 36.5,61 CN3.P$21
N$113
  Top 0.203: R39.1 30.75,77.75 31.5,77 31.5,61 CN3.P$23
N$114
  Top 0.203: R38.1 25.5,77.75 26.5,76.75 26.5,61.25 26.25,61 CN3.P$25
N$115
  Top 0.203: R37.1 20.5,77.75 21.5,76.75 21.5,61.25 21.25,61 CN3.P$27
N$116
  Top 0.203: B-D4.P$1 24,10 24.75,10.75 24.75,42.75 24.25,43.25 23,43.25 23,45 24,46 24,53.5 23.5,54 CN1.P$5
N$117
  Top 0.203: B-E4.P$1 8,5.25 8.75,4.5 25.75,4.5 25.75,54 CN1.P$6
N$118
  Top 0.203: B-F4.P$1 10,46.75 14.5,51.25 14.5,54.75 16,56.25 28.25,56.25 28.25,54 CN1.P$7
N$119  (via drill 0.3)
  Top 0.203: v28.5,27 29.25,27.75 29.25,52.5 30.75,54 CN1.P$8
  Bottom 0.203: v28.5,27 24,27 B-G4.P$1
N$120
  Top 0.203: B-A3.P$1 47,47 42.25,51.75 37.25,51.75 37.25,54.5 36.5,55.25 33.5,55.25 CN1.P$9
N$121
  Top 0.203: B-B3.P$1 46,46.5 41.25,51.25 36.25,51.25 36.25,54 CN1.P$10
N$122  (via drill 0.3)
  Top 0.203: v50,44 50,4.5 45,4.5 44,5.5 B-C3.P$1
  Bottom 0.203: v50,44 41.75,52.25 40.25,52.25 38.5,54 CN1.P$11
N$123
  Top 0.203: B-D3.P$1 49.25,12.25 49.25,53 50,53.75 50,54.25 49,55.25 47.25,55.25 47.25,53.25 46.25,52.25 41.25,52.25 41.25,54 CN1.P$12
N$124
  Top 0.203: B-E3.P$1 30.75,5.75 27.75,8.75 27.75,51.75 29.75,53.75 29.75,54.5 31.5,56.25 43.5,56.25 43.5,54 CN1.P$13
N$125
  Top 0.203: B-F3.P$1 33,46.5 32.25,47.25 32.25,54.75 33.25,55.75 42.5,55.75 42.5,53.5 43.25,52.75 46,52.75 46,54 CN1.P$14
N$126
  Top 0.203: B-G3.P$1 48.5,28.5 48.5,54 CN1.P$15
N$127  (via drill 0.3)
  Top 0.203: B-A2.P$1 70.5,44.5 70.5,51 67.75,53.75 67.75,54.5 66,56.25 v53.5,56.25
  Bottom 0.203: v53.5,56.25 51.25,54 CN1.P$16
N$128
  Top 0.203: B-B2.P$1 69,46.5 65.25,50.25 65.25,54.25 63.75,55.75 54,55.75 54,54 CN1.P$17
N$129
  Top 0.203: B-C2.P$1 66.75,5.5 56.75,5.5 56.75,4.75 56.5,4.5 51.75,4.5 51.75,48.5 56.25,53 56.25,54 CN1.P$18
N$130
  Top 0.203: B-D2.P$1 71.25,11.25 71.25,52.75 70.25,53.75 70.25,54.5 67.75,57 52.75,57 52.75,53.5 53.5,52.75 55.25,52.75 55.25,54.5 56,55.25 58.75,55.25 58.75,54 CN1.P$19
N$131
  Top 0.203: B-E2.P$1 53.75,5.75 52.25,7.25 52.25,46.25 58.75,52.75 61.25,52.75 61.25,54 CN1.P$20
N$132
  Top 0.203: B-F2.P$1 56.25,46.5 63.75,54 CN1.P$21
N$133
  Top 0.203: B-G2.P$1 70.75,27.75 70.75,41 69,41 69,44.75 70,45.75 70,50.75 66.75,54 CN1.P$22
N$134
  Bottom 0.203: B-A1.P$1 75.5,42 69,48.5 69,54 CN1.P$23
N$135
  Top 0.203: B-B1.P$1 92,46.5 85.5,53 85.5,55.75 84.5,56.75 71.75,56.75 71.75,54 CN1.P$24
N$136
  Top 0.203: B-C1.P$1 89.75,5.5 79.75,5.5 79.75,4.75 79.5,4.5 74,4.5 74,54 CN1.P$25
N$137
  Top 0.203: B-D1.P$1 74.5,9.5 74.5,52 76.5,54 CN1.P$26
N$138
  Top 0.203: B-E1.P$1 77,5.75 77,10.5 76.5,11 75,11 75,50 79,54 CN1.P$27
N$139
  Top 0.203: CN1.P$28 81.75,49 79.25,46.5 B-F1.P$1
N$140  (via drill 0.3)
  Top 0.203: v72.75,25 72.75,54.75 72.25,55.25 72.25,55.75 72.75,56.25 84.25,56.25 84.25,54 CN1.P$29
  Bottom 0.203: v72.75,25 B-G1.P$1
V+
  pour Bottom: 0,57.23 100,57.23 100,0 0,0

### Text on the board
tPlace: A4 | A3 | A2 | A1 | F4 | F3 | B3 | B2 | B4 | F2 | F1 | B1 | G4 | G3 | G2 | G1 | E4 | C4 | C3 | E2 | C2 | E1 | C1 | D4 | D3 | D2 | D1